# Altium schematic sheet Open SDA schematic.SchDoc
size A4
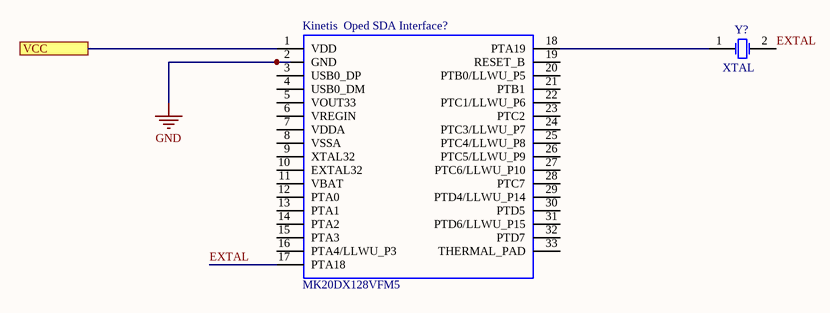
[diagram p0: Open SDA schematic.SchDoc]

## Parts
Kinetis_Oped_SDA_Interface?  MK20DX128VFM5  [SOT617-14]
Y?  XTAL  [R38]

## Ports
VCC

## Nets
GND: Kinetis_Oped_SDA_Interface?.2(GND)
EXTAL: Kinetis_Oped_SDA_Interface?.17(PTA18) Y?.2(OSC2)
VCC: Kinetis_Oped_SDA_Interface?.1(VDD) ; port VCC
NetKinetis_Oped_SDA_Interface?_18: Kinetis_Oped_SDA_Interface?.18(PTA19) Y?.1(OSC1)

Not connected (* = marked no-connect by the designer): Kinetis_Oped_SDA_Interface? 3(USB0_DP) 4(USB0_DM) 5(VOUT33) 6(VREGIN) 7(VDDA) 8(VSSA) 9(XTAL32) 10(EXTAL32) 11(VBAT) 12(PTA0) 13(PTA1) 14(PTA2) 15(PTA3) 16(PTA4/LLWU_P3) 19(RESET_B) 20(PTB0/LLWU_P5) 21(PTB1) 22(PTC1/LLWU_P6) 23(PTC2) 24(PTC3/LLWU_P7) 25(PTC4/LLWU_P8) 26(PTC5/LLWU_P9) 27(PTC6/LLWU_P10) 28(PTC7) 29(PTD4/LLWU_P14) 30(PTD5) 31(PTD6/LLWU_P15) 32(PTD7) 33(THERMAL_PAD)

## Library data of the parts
Kinetis_Oped_SDA_Interface? = MK20DX128VFM5: MCU, Kinetis, MK20DX128VFM5, QFN32 Freescale MK20DX128VFM5, 32bit ARM Cortex M4 MCU, 50MHz, 160 kB Flash, 32-Pin QFN; Manufacturer_Name: NXP; Geometry.Height: mm; Supplier_Name: RS; RS Part Number: 8181223; Manufacturer_Part_Number: MK20DX128VFM5; Allied_Number: *; Other Part Number: *; Datasheet Link: http://www.nxp.com/docs/en/data-sheet/K20P32M50SF0.pdf; 3D Package: *
Y? = XTAL: Crystal Oscillator; Published: 8-Jun-2000; LatestRevisionDate: 17-Jul-2002; LatestRevisionNote: Re-released for DXP Platform.; PackageReference: R38; Publisher: Altium Limited; PackageDescription: Crystal, Thru-Hole; 2 Leads; Body 3.1 x 8.2 mm (Dia.xH)